# Altium schematic sheet [04] - REVISION HISTORY.SchDoc
size A4; DocumentNumber: 4; SheetNumber: 4; SheetTotal: 5
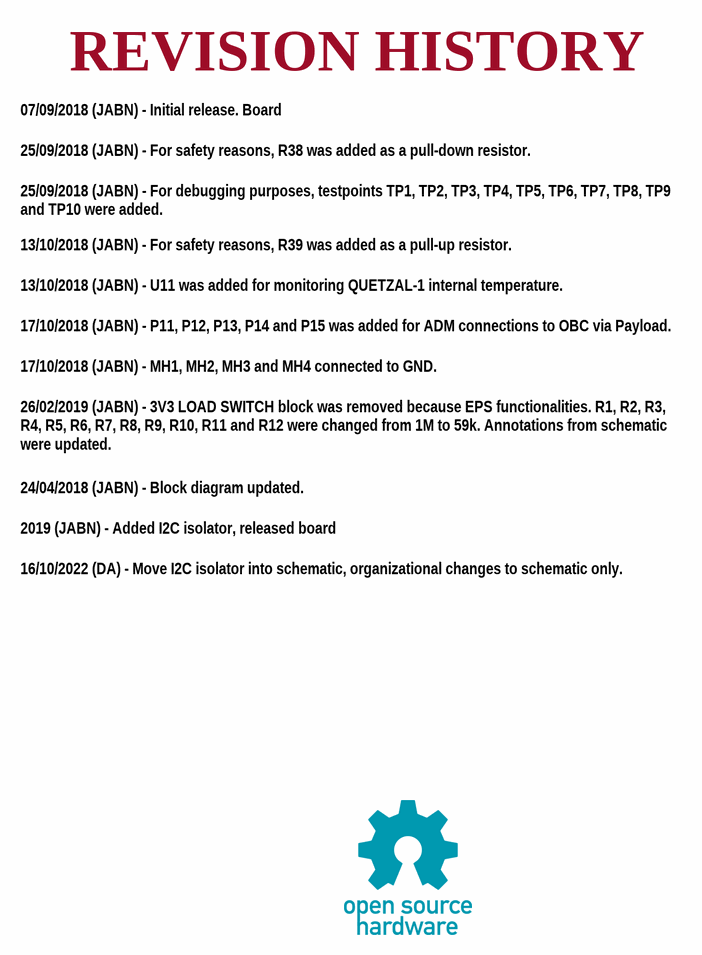
[diagram p0: [04] - REVISION HISTORY.SchDoc]

## Notes on the sheet
- 07/09/2018 (JABN) - Initial release. Board
- REVISION HISTORY
- 25/09/2018 (JABN) - For safety reasons, R38 was added as a pull-down resistor.
- 25/09/2018 (JABN) - For debugging purposes, testpoints TP1, TP2, TP3, TP4, TP5, TP6, TP7, TP8, TP9 and TP10 were added.
- 13/10/2018 (JABN) - For safety reasons, R39 was added as a pull-up resistor.
- 13/10/2018 (JABN) - U11 was added for monitoring QUETZAL-1 internal temperature.
- 17/10/2018 (JABN) - P11, P12, P13, P14 and P15 was added for ADM connections to OBC via Payload.
- 17/10/2018 (JABN) - MH1, MH2, MH3 and MH4 connected to GND.
- 26/02/2019 (JABN) - 3V3 LOAD SWITCH block was removed because EPS functionalities. R1, R2, R3, R4, R5, R6, R7, R8, R9, R10, R11 and R12 were changed from 1M to 59k. Annotations from schematic were updated.
- 24/04/2018 (JABN) - Block diagram updated.
- 16/10/2022 (DA) - Move I2C isolator into schematic, organizational changes to schematic only.
- 2019 (JABN) - Added I2C isolator, released board
- Project:
- Page Contents:
- Size:
- Revision:
- A4
- Document Number:
- Design:
- Date:
- Sheet
- of